# EAGLE design TDA2040_Amp_v2.2 (EAGLE 9.6.2)
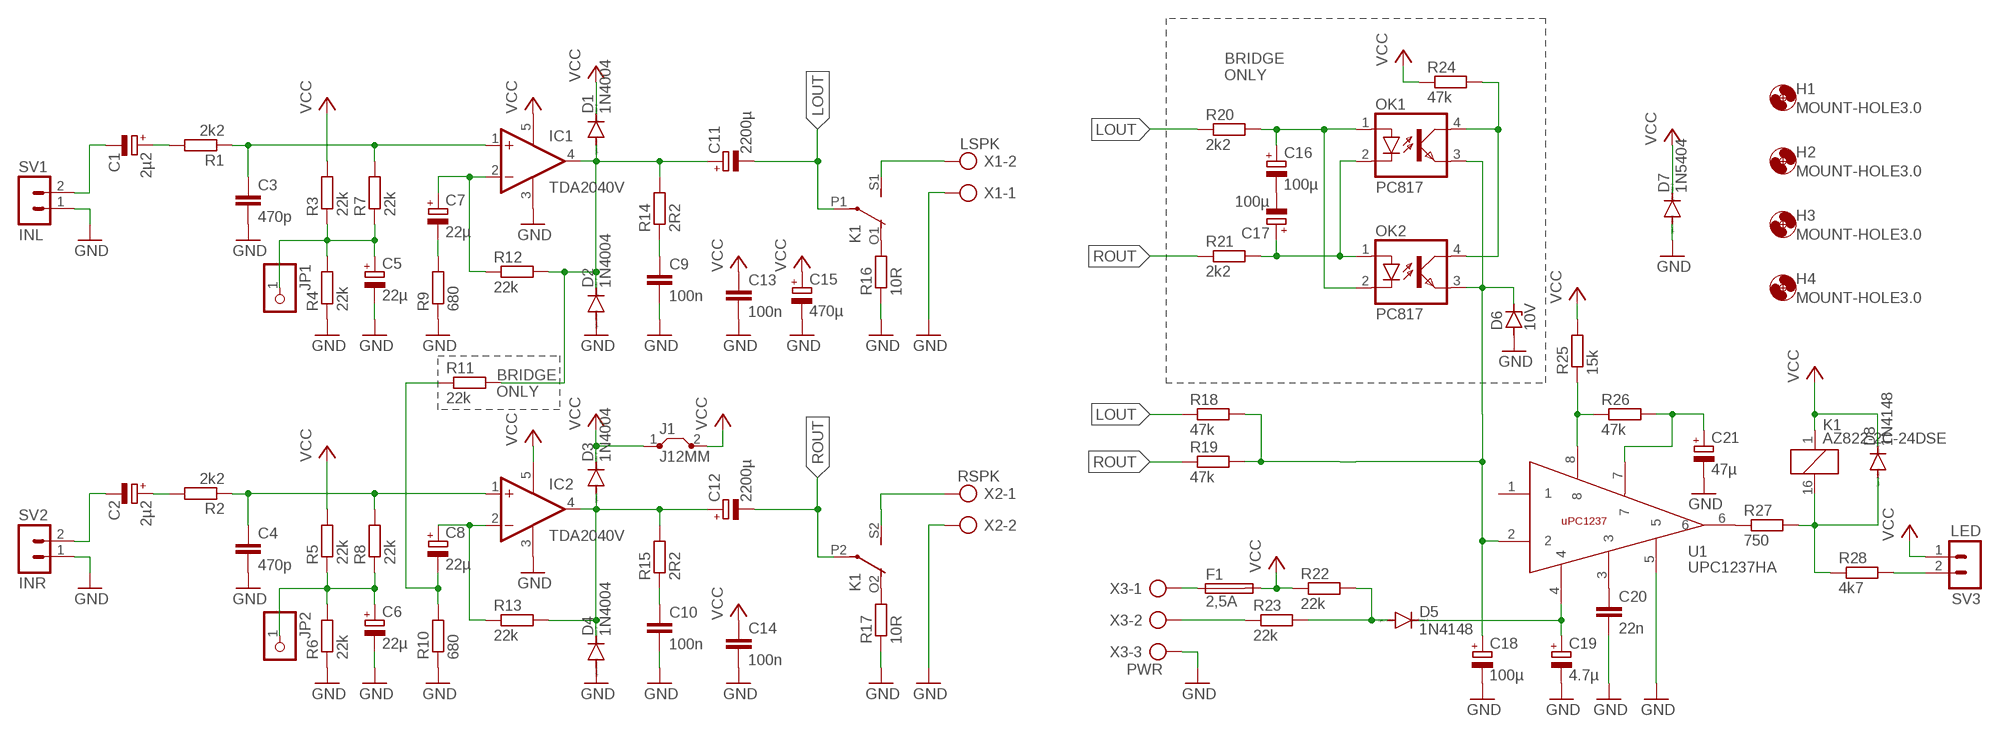
[diagram p0: schematic, sheet 1]

## Parts
C1  2µ2  CPOL-EUE2.5-5  [E2,5-5]
C2  2µ2  CPOL-EUE2.5-5  [E2,5-5]
C3  470p  C-EU050-024X044  [C050-024X044]
C4  470p  C-EU050-024X044  [C050-024X044]
C5  22µ  CPOL-EUE2.5-6  [E2,5-6]
C6  22µ  CPOL-EUE2.5-6  [E2,5-6]
C7  22µ  CPOL-EUE2.5-6  [E2,5-6]
C8  22µ  CPOL-EUE2.5-6  [E2,5-6]
C9  100n  C-EU050-024X044  [C050-024X044]
C10  100n  C-EU050-024X044  [C050-024X044]
C11  2200µ  CPOL-EUE5-13  [E5-13]
C12  2200µ  CPOL-EUE5-13  [E5-13]
C13  100n  C-EU050-024X044  [C050-024X044]
C14  100n  C-EU050-024X044  [C050-024X044]
C15  470µ  CPOL-EUE5-13  [E5-13]
C16  100µ  CPOL-EUE2.5-6  [E2,5-6]
C17  100µ  CPOL-EUE2.5-6  [E2,5-6]
C18  100µ  CPOL-EUE2.5-5  [E2,5-5]
C19  4.7µ  CPOL-EUE2.5-5  [E2,5-5]
C20  22n  C-EU050-024X044  [C050-024X044]
C21  47µ  CPOL-EUE2.5-5  [E2,5-5]
D1  1N4004  [DO41-10]
D2  1N4004  [DO41-10]
D3  1N4004  [DO41-10]
D4  1N4004  [DO41-10]
D5  1N4148  1N4148DO35-7  [DO35-7]
D6  10V  ZENER-DIODEDO34-7  [DO34Z7]
D7  1N5404  1N5400  [DO201-15]
D8  1N4148  1N4148DO35-7  [DO35-7]
F1  2,5A  SH22  [SH22]
H1  MOUNT-HOLE3.0  [3,0]
H2  MOUNT-HOLE3.0  [3,0]
H3  MOUNT-HOLE3.0  [3,0]
H4  MOUNT-HOLE3.0  [3,0]
IC1  TDA2040V  [CB360]
IC2  TDA2040V  [CB360]
J1  J12MM  [12]
JP1  PINHD-1X1A  [1X01A]
JP2  PINHD-1X1A  [1X01A]
K1  AZ822-2C-24DSE  351  [351]
OK1  PC817  [DIL04]
OK2  PC817  [DIL04]
R1  2k2  R-EU_0207/10  [0207/10]
R2  2k2  R-EU_0207/10  [0207/10]
R3  22k  R-EU_0207/10  [0207/10]
R4  22k  R-EU_0207/10  [0207/10]
R5  22k  R-EU_0207/10  [0207/10]
R6  22k  R-EU_0207/10  [0207/10]
R7  22k  R-EU_0207/10  [0207/10]
R8  22k  R-EU_0207/10  [0207/10]
R9  680  R-EU_0207/10  [0207/10]
R10  680  R-EU_0207/10  [0207/10]
R11  22k  R-EU_0207/10  [0207/10]
R12  22k  R-EU_0207/10  [0207/10]
R13  22k  R-EU_0207/10  [0207/10]
R14  2R2  R-EU_0207/10  [0207/10]
R15  2R2  R-EU_0207/10  [0207/10]
R16  10R  R-EU_0207/10  [0207/10]
R17  10R  R-EU_0207/10  [0207/10]
R18  47k  R-EU_0207/10  [0207/10]
R19  47k  R-EU_0207/10  [0207/10]
R20  2k2  R-EU_0207/10  [0207/10]
R21  2k2  R-EU_0207/10  [0207/10]
R22  22k  R-EU_0207/10  [0207/10]
R23  22k  R-EU_0207/10  [0207/10]
R24  47k  R-EU_0207/10  [0207/10]
R25  15k  R-EU_0207/10  [0207/10]
R26  47k  R-EU_0207/10  [0207/10]
R27  750  R-EU_0207/10  [0207/10]
R28  4k7  R-EU_0207/10  [0207/10]
SV1  INL  MA02-1  [MA02-1]
SV2  INR  MA02-1  [MA02-1]
SV3  LED  MA02-1  [MA02-1]
U1  UPC1237HA  [SIP8]
X1  LSPK  AK500/2  [AK500/2]
X2  RSPK  AK500/2  [AK500/2]
X3  PWR  AK500/3  [AK500/3]

## Nets
GND: C3.2 C4.2 C5.- C6.- C9.2 C10.2 C13.2 C14.2 C15.- C18.- C19.- C20.2 C21.- D2.A D4.A D6.A D7.A IC1.3(V-) IC2.3(V-) R4.1 R6.1 R9.1 R10.1 R16.1 R17.1 SV1.1 SV2.1 U1.5 X1.1 X2.2 X3.3
LOUT: C11.- K1.P1(2:P) R18.1 R20.1
N$1: C18.+ D6.C OK1.3(EMIT) OK2.3(EMIT) R18.2 R19.2 U1.2
N$2: C19.+ D5.C U1.4
N$3: R25.1 R26.1 U1.8
N$4: C21.+ R26.2 U1.7
N$5: C20.1 U1.3
N$6: R27.1 U1.6
N$7: F1.1 X3.1
N$8: D5.A R22.2 R23.2
N$9: R23.1 X3.2
N$10: D8.A K1.16 R27.2 R28.1
N$11: K1.O2(3:O) R17.2
N$12: K1.O1(2:O) R16.2
N$13: K1.S1(2:S) X1.2
N$14: C7.+ IC1.2(-IN) R12.1
N$15: C11.+ D1.A D2.C IC1.4(OUT) R11.2 R12.2 R14.2
N$16: C3.1 IC1.1(+IN) R1.1 R7.2
N$17: C7.- R9.2
N$18: C5.+ JP1.1 R3.1 R4.2 R7.1
N$19: C17.+ OK1.2(C) OK2.1(A) R21.2
N$20: C9.1 R14.1
N$21: C1.- SV1.2
N$22: C8.+ IC2.2(-IN) R13.1
N$23: C12.+ D3.A D4.C IC2.4(OUT) R13.2 R15.2
N$24: C4.1 IC2.1(+IN) R2.1 R8.2
N$25: C8.- R10.2 R11.1
N$26: C6.+ JP2.1 R5.1 R6.2 R8.1
N$27: C10.1 R15.1
N$28: C16.+ OK1.1(A) OK2.2(C) R20.2
N$29: C2.- SV2.2
N$30: K1.S2(3:S) X2.1
N$32: C16.- C17.-
N$33: C1.+ R1.2
N$34: OK1.4(COL) OK2.4(COL) R24.2
N$36: C2.+ R2.2
N$38: R28.2 SV3.2
ROUT: C12.- K1.P2(3:P) R19.1 R21.1
VCC: C13.1 C14.1 C15.+ D1.C D3.C D7.C D8.C F1.2 IC1.5(V+) IC2.5(V+) J1.1 J1.2 K1.1 R3.2 R5.2 R22.1 R24.1 R25.2 SV3.1
Unconnected: U1.1

## Notes on the sheet
- BRIDGE
  ONLY
- BRIDGE
  ONLY

## Library data of the parts
C1 C2 C5-C8 C11 C12 C15-C19 C21 = rcl-custom:CPOL-EU: POLARIZED CAPACITOR, European symbol; SPICEPREFIX: C
C3 C4 C9 C10 C13 C14 C20 = rcl-custom:C-EU: CAPACITOR, European symbol; SPICEPREFIX: C
D1-D4 = diode-custom:1N4004: DIODE general purpose rectifier, 1 A
D5 D8 = diode:1N4148: DIODE high speed (Philips)
D6 = diode:ZENER-DIODE: Z-Diode
D7 = diode:1N5400: DIODE standard rectifier, 3 A, 50 V (Motorola)
F1 = fuse:SH22: FUSE HOLDER CS PFP30, Schukat; OC_FARNELL: unknown; OC_NEWARK: unknown
H1-H4 = holes-custom:MOUNT-HOLE: MOUNTING HOLE with drill center marker
IC1 IC2 = linear:TDA2040: Power OP AMP
J1 = jumper-custom:J: Bridge
JP1 JP2 = pinhead-custom:PINHD-1X1: PIN HEADER
K1 = relay:351: RELAY 2 x switch, Omron
OK1 OK2 = optocoupler:PC817: SHARP OPTO COUPLER; MPN: PC817X4J000F; OC_FARNELL: 9707727; OC_NEWARK: 97K7059
R1-R28 = rcl-custom:R-EU_: RESISTOR, European symbol; SPICEPREFIX: R
SV1-SV3 = con-lstb-custom:MA02-1: PIN HEADER
U1 = UPC1237HA:UPC1237HA: Check availability <https://pricing.snapeda.com/parts/UPC1237HA/NEC/view-part?ref=eda>; AVAILABILITY: Not in stock; CHECK_PRICES: https://www.snapeda.com/parts/UPC1237HA/NEC/view-part/?ref=eda; DESCRIPTION: Original NEC Linear Monolithic IC; MF: NEC; MP: UPC1237HA; PACKAGE: None; PRICE: None; SNAPEDA_LINK: https://www.snapeda.com/parts/UPC1237HA/NEC/view-part/?ref=snap
X1 X2 = con-ptr500:AK500/2: CONNECTOR; OC_FARNELL: unknown; OC_NEWARK: unknown
X3 = con-ptr500:AK500/3: CONNECTOR; OC_FARNELL: unknown; OC_NEWARK: unknown

## Board
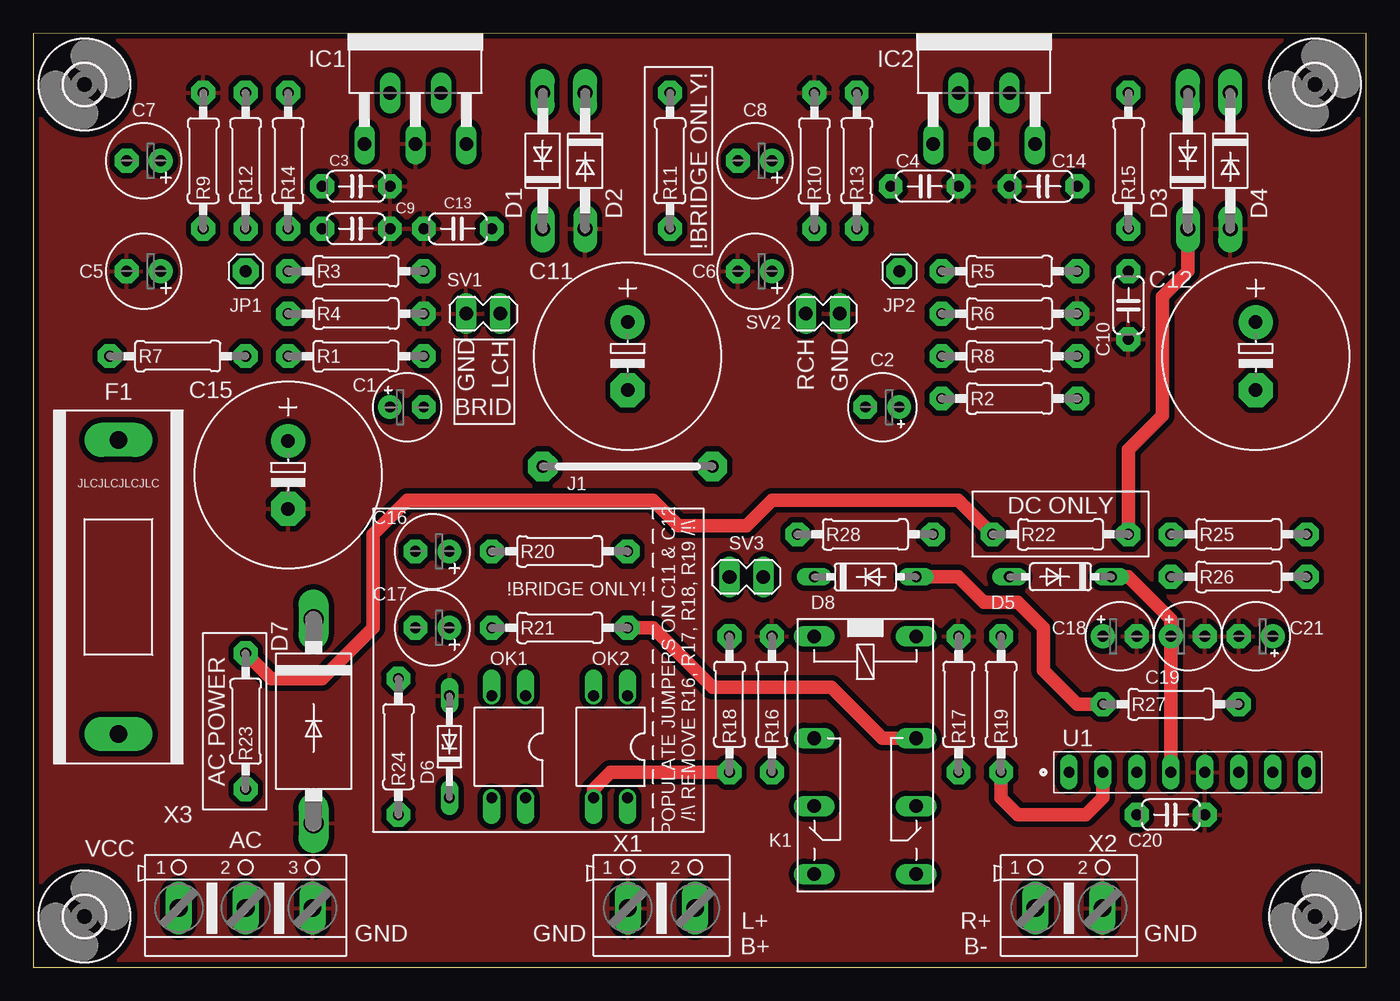
[diagram p1: board, top side]
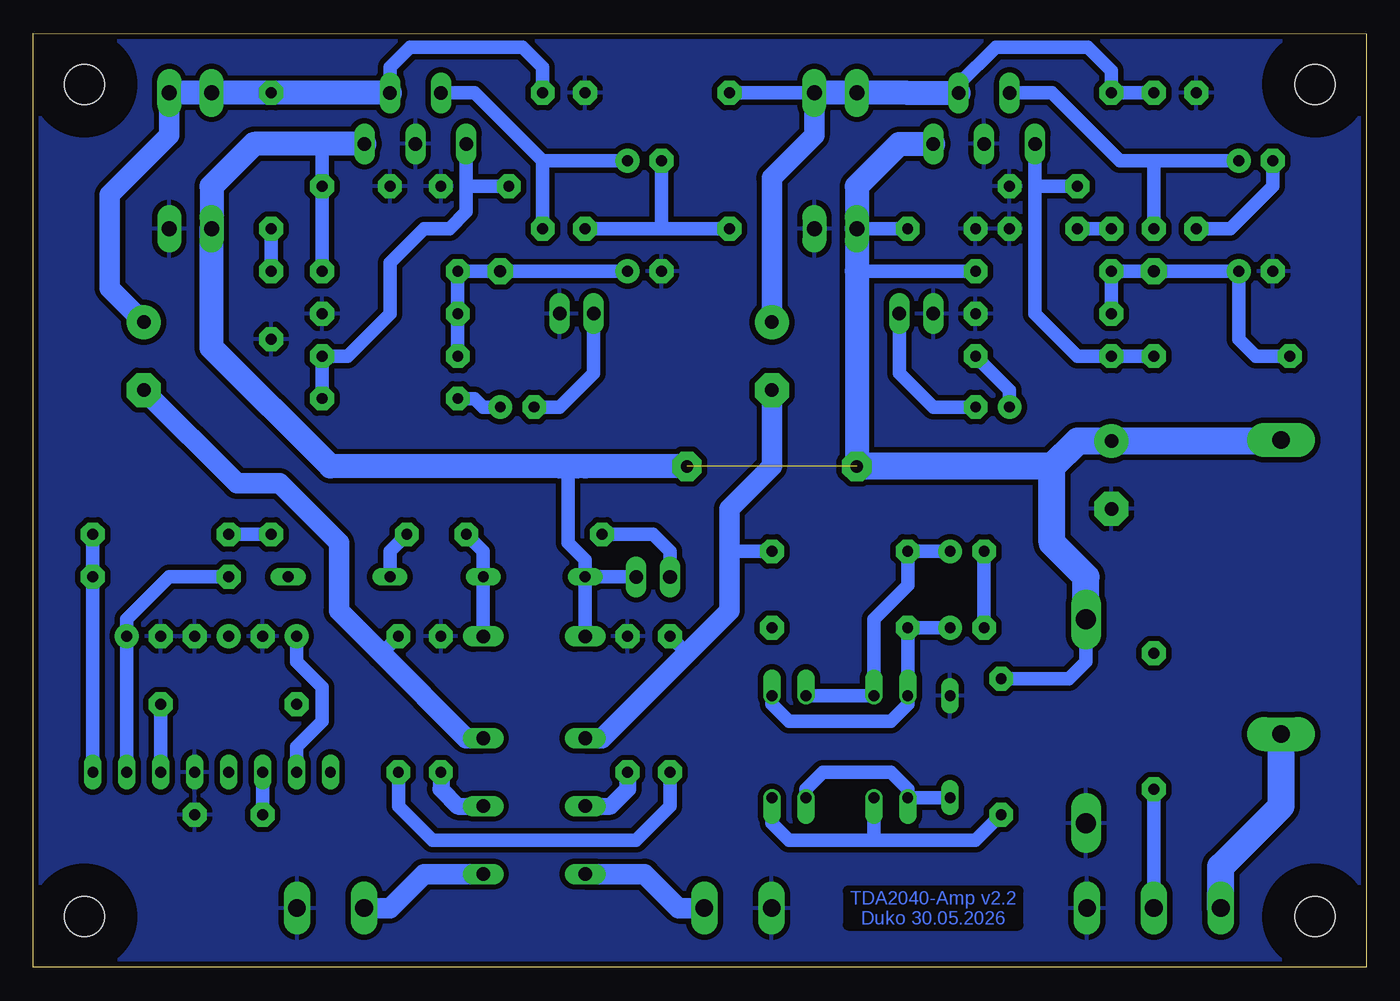
[diagram p2: board, bottom side, seen from below]

Size 99.69 x 69.85 mm. Coordinates in mm from the lower left corner, seen from the top.
Outline: 0,0 99.69,0 99.69,69.85 0,69.84 0,0
Copper layers (1*16): Top 0.035mm / dielectric 1.5mm / Bottom 0.035mm
Design rules "default *": minimum track width 6mil, minimum drill 0.35mm, track to track 6mil, track to pad 6mil, pad to pad 6mil, via to via 6mil, smd to smd 6mil, copper to edge 16mil, drill to drill 6mil, minimum pad ring 10mil, minimum via ring 8mil, stop-mask expansion 4mil, vias tented up to drill 14mil, thermal gap 16mil

### Footprints (pad centres in the part's own frame; a part is rotated, then mirrored left to right if it is on the bottom)
E2,5-5 = drill 0.813 pad 1.778: + -1.27,0 | drill 0.813 pad 1.778 octagon: - 1.27,0
C050-024X044 = drill 0.813 pad 1.778 octagon: 1 -2.54,0; 2 2.54,0
E2,5-6 = drill 0.813 pad 1.778: + -1.27,0 | drill 0.813 pad 1.778 octagon: - 1.27,0
E5-13 = drill 1.016 pad 2.54: + -2.54,0 | drill 1.016 pad 2.54 octagon: - 2.54,0
DO41-10 = drill 1.118 pad 1.778 long: A 5.08,0; C -5.08,0
DO35-7 = drill 0.813 long: A 3.81,0; C -3.81,0
DO34Z7 = drill 0.813 long: A 3.81,0; C -3.81,0
DO201-15 = drill 1.499 long: A 7.62,0; C -7.62,0
SH22 = drill 1.321 pad 2.54 long: 1 -10.998,0; 2 10.998,0
3,0 = hole 3: 0,0
CB360 = drill 1.016 long: 1 -3.81,-8.255; 2 -1.905,-4.445; 3 0,-8.255; 4 1.905,-4.445; 5 3.81,-8.255
12 = drill 0.914 pad 2.184 octagon: 1 -6.35,0; 2 6.35,0
1X01A = drill 0.9 pad 1.93 octagon: 1 0,0
351 = drill 1.016 long: 1 -3.81,-3.81; 16 -3.81,3.81; O1 8.89,-3.81; O2 8.89,3.81; P1 3.81,-3.81; P2 3.81,3.81; S1 13.97,-3.81; S2 13.97,3.81
DIL04 = drill 0.813 offset: 1 -1.27,-3.81; 2 1.27,-3.81; 3 1.27,3.81; 4 -1.27,3.81
0207/10 = drill 0.813 pad 1.778 octagon: 1 -5.08,0; 2 5.08,0
MA02-1 = drill 1.016 long: 1 -1.27,0; 2 1.27,0
SIP8 = drill 0.8 long: 1 -8.89,0; 2 -6.35,0; 3 -3.81,0; 4 -1.27,0; 5 1.27,0; 6 3.81,0; 7 6.35,0; 8 8.89,0
AK500/2 = drill 1.321 long: 1 -2.515,0; 2 2.515,0
AK500/3 = drill 1.321 long: 1 -5.004,0; 2 0,0; 3 5.004,0

### Placement (x,y rotation side)
C1  27.94,41.91 0 top
C2  63.5,41.91 180 top
C3  24.13,58.42 0 top
C4  66.67,58.42 0 top
C5  8.26,52.07 180 top
C6  53.98,52.07 180 top
C7  8.26,60.33 180 top
C8  53.98,60.33 180 top
C9  24.13,55.24 0 top
C10  81.92,49.53 270 top
C11  44.45,45.72 270 top
C12  91.44,45.72 270 top
C13  31.75,55.24 180 top
C14  75.56,58.42 180 top
C15  19.05,36.83 270 top
C16  29.84,31.11 180 top
C17  29.84,25.4 180 top
C18  81.28,24.77 0 top
C19  86.36,24.77 0 top
C20  85.09,11.43 0 top
C21  91.44,24.77 180 top
D1  38.1,60.33 90 top
D2  41.27,60.33 270 top
D3  86.36,60.33 90 top
D4  89.53,60.33 270 top
D5  76.83,29.21 180 top
D6  31.11,16.51 90 top
D7  20.95,18.41 270 top
D8  62.23,29.21 0 top
F1  6.35,28.45 90 top
H1  95.89,3.81 0 top
H2  3.81,3.81 0 top
H3  95.89,66.04 0 top
H4  3.81,66.04 0 top
IC1  28.57,69.85 0 top
IC2  71.12,69.85 0 top
J1  44.45,37.47 0 top
JP1  15.88,52.07 0 top
JP2  64.77,52.07 0 top
K1  62.23,20.95 270 top
OK1  35.56,16.51 180 top
OK2  43.18,16.51 180 top
R1  24.13,45.72 0 top
R2  73.03,42.55 180 top
R3  24.13,52.07 0 top
R4  24.13,48.9 180 top
R5  73.03,52.07 0 top
R6  73.03,48.9 180 top
R7  10.79,45.72 0 top
R8  73.03,45.72 0 top
R9  12.7,60.33 270 top
R10  58.42,60.33 270 top
R11  47.62,60.33 90 top
R12  15.88,60.33 90 top
R13  61.59,60.33 90 top
R14  19.05,60.33 90 top
R15  81.92,60.33 90 top
R16  55.24,19.68 270 top
R17  69.22,19.68 270 top
R18  52.07,19.68 270 top
R19  72.39,19.68 270 top
R20  39.37,31.11 180 top
R21  39.37,25.4 180 top
R22  76.83,32.38 180 top
R23  15.88,18.41 90 top
R24  27.3,16.51 270 top
R25  90.17,32.38 180 top
R26  90.17,29.21 180 top
R27  85.09,19.68 180 top
R28  62.23,32.38 180 top
SV1  33.66,48.9 0 top
SV2  59.05,48.9 180 top
SV3  53.34,29.21 180 top
U1  86.36,14.61 0 top
X1  46.99,4.45 0 top
X2  77.47,4.45 0 top
X3  15.88,4.45 0 top

### Tracks (layer width: path | path; a pad name or v marks a point on that pad's centre or on a via)
GND
  pour Bottom (isolate 0.406): -2.54,72.39 -2.54,-2.54 102.23,-2.54 102.23,72.39
  pour Top (isolate 0.406): -6.35,76.2 -6.35,-6.99 106.05,-6.99 106.05,76.2
LOUT
  Bottom 1.016: R18.1 50.8,23.5 | R20.1 47.62,31.11
  Bottom 1.524: K1.P1 57.15,17.14 50.8,23.5 47.62,26.67 47.62,31.11 47.62,31.75 47.62,34.29 44.45,37.47 C11.-
N$1
  Top 1.016: OK2.3 41.91,13.34 43.18,14.61 R18.2 | R19.2 72.39,12.7 73.66,11.43 78.74,11.43 80.01,12.7 U1.2
  Bottom 1.016: R18.2 52.07,12.06 54.61,9.53 69.85,9.53 72.39,12.06 R19.2 | U1.2 80.01,16.51 78.11,18.41 78.11,20.95 80.01,22.86 C18.+ | OK2.3 41.91,13.34 40.64,14.61 35.56,14.61 34.29,13.34 OK1.3 D6.C
N$2
  Top 1.016: U1.4 C19.+ 85.09,26.04 81.92,29.21 D5.C
N$3
  Bottom 1.016: U1.8 R26.1 R25.1
N$4
  Bottom 1.016: U1.7 C21.+ 92.71,26.04 89.53,29.21 R26.2
N$5
  Bottom 1.016: C20.1 U1.3
N$6
  Bottom 1.016: U1.6 R27.1
N$7
  Bottom 2.032: X3.1 10.87,7.54 6.35,12.06 F1.1
N$8
  Top 1.016: R23.2 17.78,21.59 21.59,21.59 25.4,25.4 25.4,32.38 27.94,34.92 46.35,34.92 48.26,33.02 53.34,33.02 55.24,34.92 69.22,34.92 R22.2
  Bottom 1.016: R22.2 73.03,31.11 D5.A
N$9
  Bottom 1.016: R23.1 X3.2
N$10
  Top 1.016: D8.A 69.22,29.21 71.12,27.3 73.66,27.3 75.56,25.4 75.56,22.23 78.11,19.68 R27.2
  Bottom 1.016: K1.16 D8.A 66.04,31.11 R28.1
N$11
  Bottom 1.27: R17.2 69.22,13.34 67.94,12.06 K1.O2
N$12
  Bottom 1.27: K1.O1 56.52,12.06 55.24,13.34 R16.2
N$13
  Bottom 1.524: K1.S1 53.98,6.99 51.44,4.45 X1.2
N$14
  Bottom 1.016: C7.+ 15.88,60.33 | 15.88,60.33 16.51,60.33 18.41,60.33 23.5,65.41 IC1.2 | R12.1 15.88,60.33
N$15
  Bottom 1.016: R12.2 R14.2 19.05,67.05 20.83,68.83 27.69,68.83 30.48,66.04 IC1.4 | D2.C R11.2
  Bottom 1.524: D2.C 41.27,62.23 44.45,59.05 C11.+
  Bottom 1.778: IC1.4 34.29,65.41 D1.A D2.C
N$16
  Bottom 1.016: IC1.1 24.77,58.42 | C3.1 24.77,58.42 | 24.77,58.42 24.77,48.9 21.59,45.72 R1.1 R7.2
N$17
  Bottom 1.016: C7.- 6.99,58.42 10.16,55.24 R9.2
N$18
  Bottom 1.016: R7.1 8.26,45.72 9.53,46.99 C5.+ JP1.1 R3.1 R4.2
N$19
  Bottom 1.016: C17.+ R21.2 OK1.2 34.29,19.68 35.56,18.41 43.18,18.41 44.45,19.68 OK2.1
N$20
  Bottom 1.016: R14.1 C9.1
N$21
  Bottom 1.016: C1.- 32.38,41.91 34.92,44.45 SV1.2
N$22
  Bottom 1.016: C8.+ 61.59,60.33 | R13.1 61.59,60.33 | IC2.2 66.67,65.41 61.59,60.33
N$23
  Bottom 1.016: IC2.4 73.03,67.31 71.5,68.83 69.22,68.83 63.12,68.83 61.59,67.31 R13.2
  Bottom 1.524: D4.C 89.53,62.23 93.98,57.78 93.98,50.8 C12.+
  Bottom 1.778: D4.C D3.A R15.2 IC2.4
N$24
  Bottom 1.016: R2.1 R8.2 76.2,45.72 73.03,48.9 73.03,52.7 70.48,55.24 68.58,55.24 67.31,56.52 67.31,58.42 | IC2.1 67.31,58.42 | C4.1 67.31,58.42
N$25
  Bottom 1.016: R11.1 52.7,55.24 | 52.7,55.24 53.98,55.24 54.61,55.24 55.88,55.24 R10.2 | C8.- 52.7,55.24
N$26
  Bottom 1.016: R8.1 R6.2 R5.1 JP2.1 C6.+
N$27
  Bottom 1.016: R15.1 C10.1
N$28
  Bottom 1.016: OK2.2 OK1.1 36.83,26.04 34.29,28.57 R20.2 C16.+
N$29
  Bottom 1.016: C2.- 60.33,41.91 57.78,44.45 SV2.2
N$30
  Bottom 1.524: K1.S2 70.48,6.99 73.03,4.45 X2.1
N$32
  Bottom 1.016: C16.- C17.-
N$33
  Bottom 1.016: R1.2 26.67,43.18 C1.+
N$34
  Bottom 1.016: OK2.4 44.45,10.79 43.18,9.53 36.83,9.53 | R24.2 29.21,9.53 36.83,9.53 | OK1.4 36.83,9.53
N$36
  Bottom 1.016: R2.2 66.67,42.55 66.04,41.91 C2.+
N$38
  Bottom 1.016: R28.2 53.34,32.38 52.07,31.11 SV3.2
ROUT
  Top 1.016: R21.1 46.35,25.4 50.8,20.95 59.69,20.95 63.5,17.14 K1.P2
  Bottom 1.016: R19.1 73.66,23.5
  Bottom 1.524: C12.- 84.45,36.2 81.28,36.2 76.83,31.75 76.83,26.67 73.66,23.5 67.31,17.14 K1.P2
VCC  (1 unrouted)
  Top 1.016: R22.1 81.92,38.73 84.45,41.27 84.45,50.16 86.36,52.07 D3.C
  Bottom 1.016: C13.1 D1.C | R3.2 38.1,52.07 | R22.1 R25.2 | K1.1 D8.C | D8.C 58.42,30.48 59.69,31.75 59.69,37.47 | D8.C SV3.1 | 78.11,61.59 C14.1 R5.2 | D7.C 20.95,22.86 22.23,21.59 R24.1
  Bottom 1.778: IC1.5 34.92,61.59 38.1,58.42 D1.C 38.1,52.07 J1.1 | J1.2 58.42,37.47 59.05,37.47 59.69,37.47 60.33,37.47 77.47,37.47 86.36,46.35 86.36,52.07 D3.C 86.36,58.42 83.19,61.59 78.11,61.59 IC2.5 | D7.C 20.95,27.3 | F1.2 6.35,39.37
  Bottom 2.032: 23.5,37.47 J1.1 | 6.35,39.37 C15.+ 21.59,39.37 23.5,37.47 | D7.C 20.95,29.21 23.5,31.75 23.5,37.47

### Text on the board
Bottom: TDA2040-Amp v2.2 / Duko 30.05.2026
tPlace: POPULATE JUMPERS ON C11 & C12 / /\!\\ REMOVE R16, R17, R18, R19 /\!\\
tNames: \!BRIDGE ONLY! | GND | LCH | RCH | GND | BRID | JLCJLCJLCJLC | DC ONLY | \!BRIDGE ONLY! | AC POWER | AC | VCC | GND | GND | L+ / B+ | R+ / B- | GND